# EAGLE design PCB (EAGLE 9.2.0)
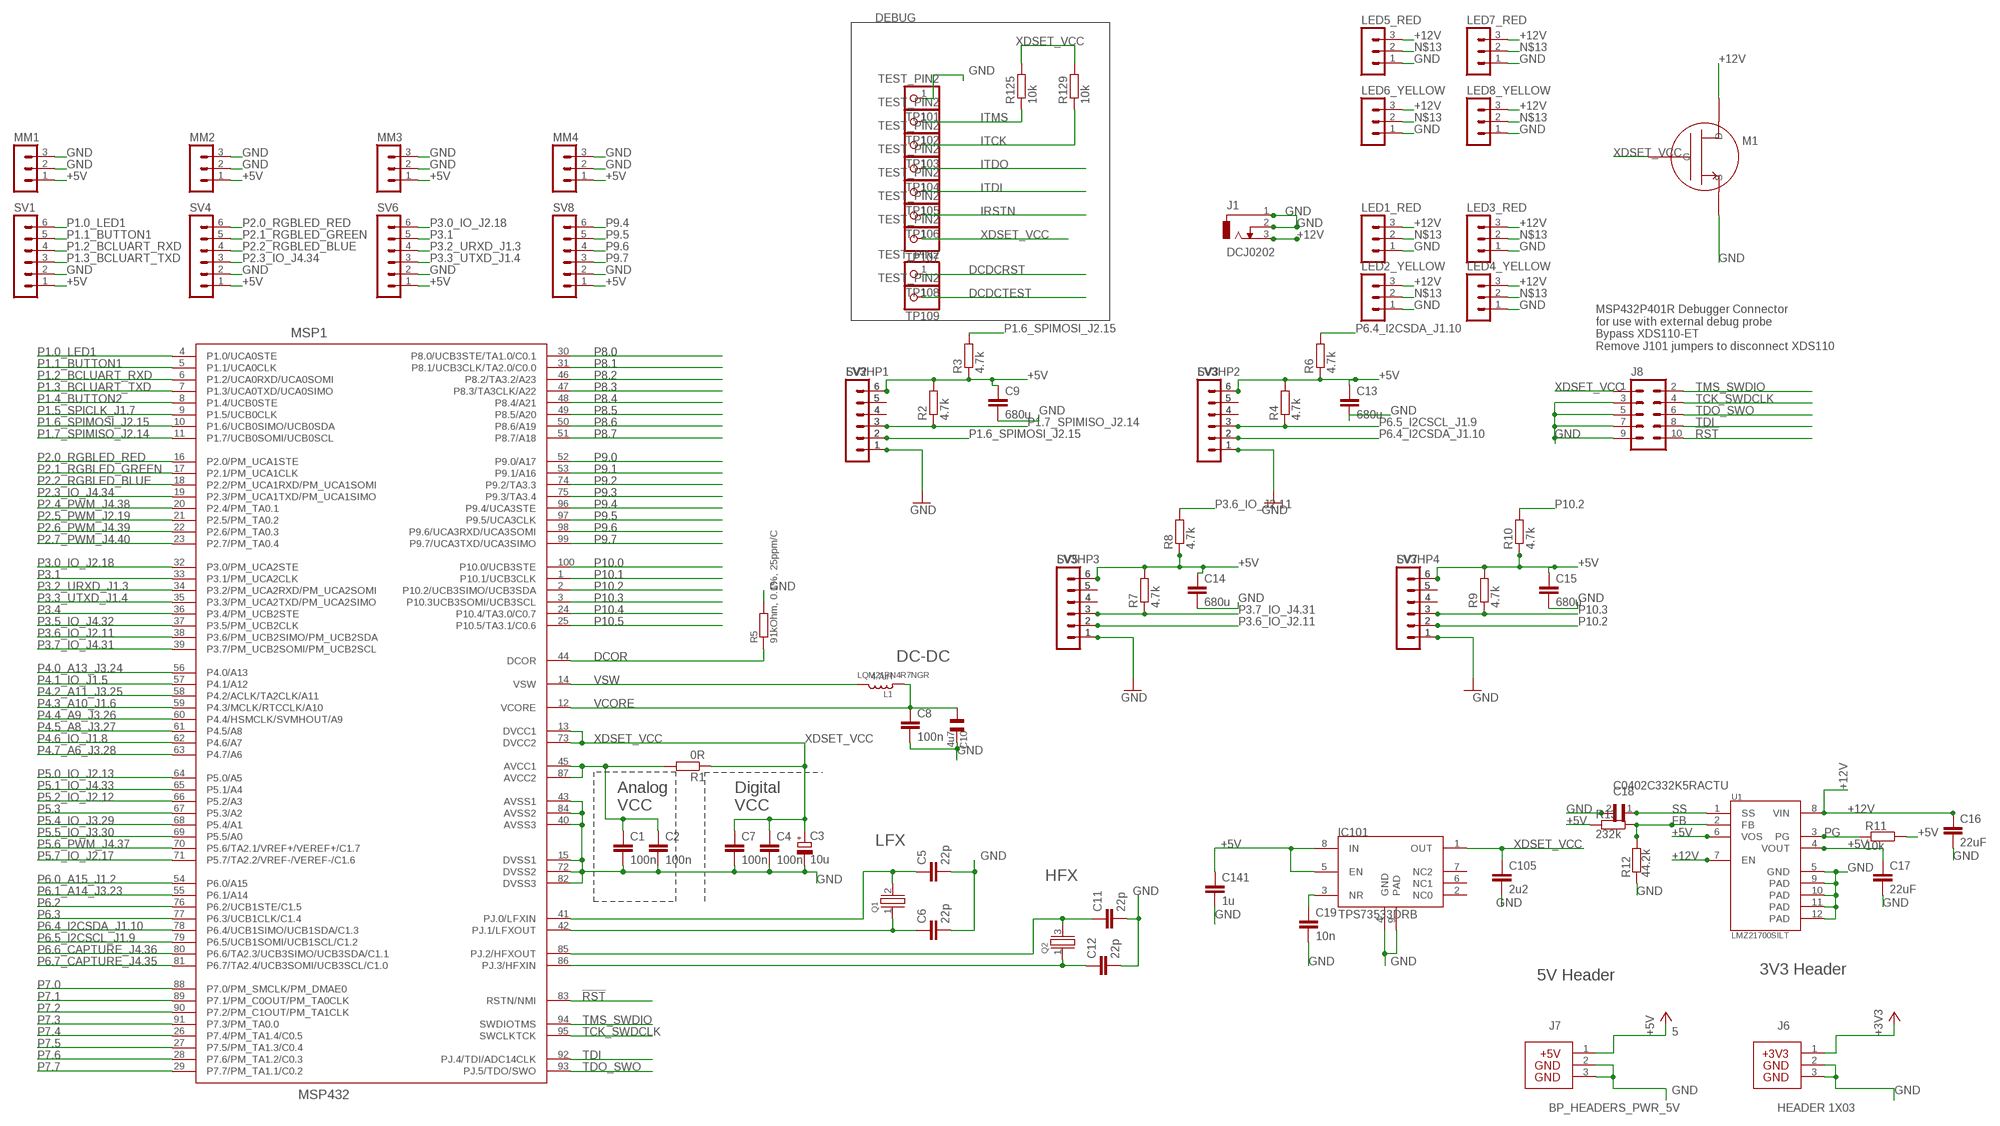
[diagram p0: schematic, sheet 1]

## Parts
C1  100n  C-EUCM0402  [0402]
C2  100n  C-EUCM0402  [0402]
C3  10u  CPOL-EUA/3216-18R  [A/3216-18R]
C4  100n  C-EUCM0402  [0402]
C5  22p  C-EUCM0402  [0402]
C6  22p  C-EUCM0402  [0402]
C7  100n  C-EUCM0402  [0402]
C8  100n  C-EUCM0402  [0402]
C9  680u  C-EUCM0402  [0402]
C10  4u7  CSMD0805  [CSMD0805]
C11  22p  C-EUCM0402  [0402]
C12  22p  C-EUCM0402  [0402]
C13  680u  C-EUCM0402  [0402]
C14  680u  C-EUCM0402  [0402]
C15  680u  C-EUCM0402  [0402]
C16  22uF  22UF-0805-6.3V-20%  [0805]
C17  22uF  22UF-0805-6.3V-20%  [0805]
C18  C0402C332K5RACTU  [CAPC1005X55N]
C19  10n  C-EUC0603  [C0603]
C105  2u2  C-EUC0603  [C0603]
C141  1u  C-EUC0603  [C0603]
IC101  TPS73533DRB  TPS73633DRB  [SON8]
J1  DCJ0202  [DCJ0202]
J6  HEADER 1X03  BP_HEADERS_PWR_3V3100-TH  [3PIN_PWR_3V3]
J7  BP_HEADERS_PWR_5V  [3PIN_PWR_5V]
J8  DEBUG_ARM-10  [ARM-10]
L1  4.7uH  LQM2MP_G0  [0806]
LED1_RED  MA03-1  [MA03-1]
LED2_YELLOW  MA03-1  [MA03-1]
LED3_RED  MA03-1  [MA03-1]
LED4_YELLOW  MA03-1  [MA03-1]
LED5_RED  MA03-1  [MA03-1]
LED6_YELLOW  MA03-1  [MA03-1]
LED7_RED  MA03-1  [MA03-1]
LED8_YELLOW  MA03-1  [MA03-1]
LV3HP1  MA06-1  [MA06-1]
LV3HP2  MA06-1  [MA06-1]
LV3HP3  MA06-1  [MA06-1]
LV3HP4  MA06-1  [MA06-1]
M1  FET_N  (no package)
MM1  MA03-1  [MA03-1]
MM2  MA03-1  [MA03-1]
MM3  MA03-1  [MA03-1]
MM4  MA03-1  [MA03-1]
MSP1  MSP432  [PZ100]
Q1  CRYSTALLF_GENERAL  [LF_XTAL]
Q2  CRYSTALEPSON_FA-238  [FA-238]
R1  0R  R-EU_RM0402  [0402]
R2  4.7k  R-EU_RM0402  [0402]
R3  4.7k  R-EU_RM0402  [0402]
R4  4.7k  R-EU_RM0402  [0402]
R5  91kOhm, 0.1%, 25ppm/C  R_0805  [0805]
R6  4.7k  R-EU_RM0402  [0402]
R7  4.7k  R-EU_RM0402  [0402]
R8  4.7k  R-EU_RM0402  [0402]
R9  4.7k  R-EU_RM0402  [0402]
R10  4.7k  R-EU_RM0402  [0402]
R11  10k  SMK  [SMK]
R12  44.2k  SMK  [SMK]
R13  232k  SMK  [SMK]
R125  10k  R-EU_RM0402  [0402]
R129  10k  R-EU_RM0402  [0402]
SV1  MA06-1  [MA06-1]
SV2  MA06-1  [MA06-1]
SV3  MA06-1  [MA06-1]
SV4  MA06-1  [MA06-1]
SV5  MA06-1  [MA06-1]
SV6  MA06-1  [MA06-1]
SV7  MA06-1  [MA06-1]
SV8  MA06-1  [MA06-1]
TP101  TEST_PIN2  PINHD-1X1  [1X01]
TP102  TEST_PIN2  PINHD-1X1  [1X01]
TP103  TEST_PIN2  PINHD-1X1  [1X01]
TP104  TEST_PIN2  PINHD-1X1  [1X01]
TP105  TEST_PIN2  PINHD-1X1  [1X01]
TP106  TEST_PIN2  PINHD-1X1  [1X01]
TP107  TEST_PIN2  PINHD-1X1  [1X01]
TP108  TEST_PIN2  PINHD-1X1  [1X01]
TP109  TEST_PIN2  PINHD-1X1  [1X01]
U1  LMZ21700SILT  [DFN350X350X175-10RN]

## Nets
5: J7.1 ; supply symbol labelled +5V
!RST: J8.10 MSP1.83(RSTN/NMI)
+3V3: J6.1
+5V: C9.1 C13.1 C14.1 C15.1 C17.1 C141.1 IC101.5(EN) IC101.8(IN) LV3HP1.6 LV3HP2.6 LV3HP3.6 LV3HP4.6 MM1.1 MM2.1 MM3.1 MM4.1 R2.2 R3.1 R4.2 R6.1 R7.2 R8.1 R9.2 R10.1 R11.1 R13.2 SV1.1 SV2.6 SV3.6 SV4.1 SV5.6 SV6.1 SV7.6 SV8.1 U1.4(VOUT) U1.6(VOS)
+12V: C16.1 J1.3 LED1_RED.3 LED2_YELLOW.3 LED3_RED.3 LED4_YELLOW.3 LED5_RED.3 LED6_YELLOW.3 LED7_RED.3 LED8_YELLOW.3 M1.D U1.7(EN) U1.8(VIN)
DCDCRST: TP108.1
DCDCTEST: TP109.1
DCOR: MSP1.44(DCOR) R5.1
FB: R12.1 R13.1 U1.2(FB)
GND: C1.2 C2.2 C3.- C4.2 C5.2 C6.2 C7.2 C8.2 C9.2 C10.2 C11.2 C12.2 C13.2 C14.2 C15.2 C16.2 C17.2 C18.2 C19.2 C105.2 C141.2 IC101.4(GND) IC101.9(PAD) J1.1 J1.2 J6.2 J6.3 J7.2 J7.3 J8.3 J8.5 J8.7 J8.9 LED1_RED.1 LED2_YELLOW.1 LED3_RED.1 LED4_YELLOW.1 LED5_RED.1 LED6_YELLOW.1 LED7_RED.1 LED8_YELLOW.1 LV3HP1.1 LV3HP2.1 LV3HP3.1 LV3HP4.1 M1.S MM1.2 MM1.3 MM2.2 MM2.3 MM3.2 MM3.3 MM4.2 MM4.3 MSP1.15(DVSS1) MSP1.40(AVSS3) MSP1.43(AVSS1) MSP1.72(DVSS2) MSP1.82(DVSS3) MSP1.84(AVSS2) R5.2 R12.2 SV1.2 SV2.1 SV3.1 SV4.2 SV5.1 SV6.2 SV7.1 SV8.2 TP101.1
IRSTN: TP106.1
ITCK: R129.1 TP103.1
ITDI: TP105.1
ITDO: TP104.1
ITMS: R125.1 TP102.1
N$1: LV3HP2.4 SV3.4
N$2: LV3HP2.5 SV3.5
N$3: LV3HP3.4 SV5.4
N$4: LV3HP1.4 SV2.4
N$5: LV3HP1.5 SV2.5
N$6: C1.1 C2.1 MSP1.45(AVCC1) MSP1.87(AVCC2) R1.2
N$7: LV3HP3.5 SV5.5
N$8: LV3HP4.4 SV7.4
N$9: LV3HP4.5 SV7.5
N$10: U1.5(GND) U1.9(PAD) U1.10(PAD) U1.11(PAD) U1.12(PAD)
N$11: C19.1 IC101.3(NR)
N$13: LED1_RED.2 LED2_YELLOW.2 LED3_RED.2 LED4_YELLOW.2 LED5_RED.2 LED6_YELLOW.2 LED7_RED.2 LED8_YELLOW.2
N$34: C6.1 MSP1.42(PJ.1/LFXOUT) Q1.1
N$38: C5.1 MSP1.41(PJ.0/LFXIN) Q1.2
P1.0_LED1: MSP1.4(P1.0/UCA0STE) SV1.6
P1.1_BUTTON1: MSP1.5(P1.1/UCA0CLK) SV1.5
P1.2_BCLUART_RXD: MSP1.6(P1.2/UCA0RXD/UCA0SOMI) SV1.4
P1.3_BCLUART_TXD: MSP1.7(P1.3/UCA0TXD/UCA0SIMO) SV1.3
P1.4_BUTTON2: MSP1.8(P1.4/UCB0STE)
P1.5_SPICLK_J1.7: MSP1.9(P1.5/UCB0CLK)
P1.6_SPIMOSI_J2.15: LV3HP1.2 MSP1.10(P1.6/UCB0SIMO/UCB0SDA) R3.2 SV2.2
P1.7_SPIMISO_J2.14: LV3HP1.3 MSP1.11(P1.7/UCB0SOMI/UCB0SCL) R2.1 SV2.3
P2.0_RGBLED_RED: MSP1.16(P2.0/PM_UCA1STE) SV4.6
P2.1_RGBLED_GREEN: MSP1.17(P2.1/PM_UCA1CLK) SV4.5
P2.2_RGBLED_BLUE: MSP1.18(P2.2/PM_UCA1RXD/PM_UCA1SOMI) SV4.4
P2.3_IO_J4.34: MSP1.19(P2.3/PM_UCA1TXD/PM_UCA1SIMO) SV4.3
P2.4_PWM_J4.38: MSP1.20(P2.4/PM_TA0.1)
P2.5_PWM_J2.19: MSP1.21(P2.5/PM_TA0.2)
P2.6_PWM_J4.39: MSP1.22(P2.6/PM_TA0.3)
P2.7_PWM_J4.40: MSP1.23(P2.7/PM_TA0.4)
P3.0_IO_J2.18: MSP1.32(P3.0/PM_UCA2STE) SV6.6
P3.1: MSP1.33(P3.1/PM_UCA2CLK) SV6.5
P3.2_URXD_J1.3: MSP1.34(P3.2/PM_UCA2RXD/PM_UCA2SOMI) SV6.4
P3.3_UTXD_J1.4: MSP1.35(P3.3/PM_UCA2TXD/PM_UCA2SIMO) SV6.3
P3.4: MSP1.36(P3.4/PM_UCB2STE)
P3.5_IO_J4.32: MSP1.37(P3.5/PM_UCB2CLK)
P3.6_IO_J2.11: LV3HP3.2 MSP1.38(P3.6/PM_UCB2SIMO/PM_UCB2SDA) R8.2 SV5.2
P3.7_IO_J4.31: LV3HP3.3 MSP1.39(P3.7/PM_UCB2SOMI/PM_UCB2SCL) R7.1 SV5.3
P4.0_A13_J3.24: MSP1.56(P4.0/A13)
P4.1_IO_J1.5: MSP1.57(P4.1/A12)
P4.2_A11_J3.25: MSP1.58(P4.2/ACLK/TA2CLK/A11)
P4.3_A10_J1.6: MSP1.59(P4.3/MCLK/RTCCLK/A10)
P4.4_A9_J3.26: MSP1.60(P4.4/HSMCLK/SVMHOUT/A9)
P4.5_A8_J3.27: MSP1.61(P4.5/A8)
P4.6_IO_J1.8: MSP1.62(P4.6/A7)
P4.7_A6_J3.28: MSP1.63(P4.7/A6)
P5.0_IO_J2.13: MSP1.64(P5.0/A5)
P5.1_IO_J4.33: MSP1.65(P5.1/A4)
P5.2/XT2IN: C12.1 MSP1.86(PJ.3/HFXIN) Q2.1
P5.2_IO_J2.12: MSP1.66(P5.2/A3)
P5.3: MSP1.67(P5.3/A2)
P5.3/XT2OUT: C11.1 MSP1.85(PJ.2/HFXOUT) Q2.3
P5.4_IO_J3.29: MSP1.68(P5.4/A1)
P5.5_IO_J3.30: MSP1.69(P5.5/A0)
P5.6_PWM_J4.37: MSP1.70(P5.6/TA2.1/VREF+/VEREF+/C1.7)
P5.7_IO_J2.17: MSP1.71(P5.7/TA2.2/VREF-/VEREF-/C1.6)
P6.0_A15_J1.2: MSP1.54(P6.0/A15)
P6.1_A14_J3.23: MSP1.55(P6.1/A14)
P6.2: MSP1.76(P6.2/UCB1STE/C1.5)
P6.3: MSP1.77(P6.3/UCB1CLK/C1.4)
P6.4_I2CSDA_J1.10: LV3HP2.2 MSP1.78(P6.4/UCB1SIMO/UCB1SDA/C1.3) R6.2 SV3.2
P6.5_I2CSCL_J1.9: LV3HP2.3 MSP1.79(P6.5/UCB1SOMI/UCB1SCL/C1.2) R4.1 SV3.3
P6.6_CAPTURE_J4.36: MSP1.80(P6.6/TA2.3/UCB3SIMO/UCB3SDA/C1.1)
P6.7_CAPTURE_J4.35: MSP1.81(P6.7/TA2.4/UCB3SOMI/UCB3SCL/C1.0)
P7.0: MSP1.88(P7.0/PM_SMCLK/PM_DMAE0)
P7.1: MSP1.89(P7.1/PM_C0OUT/PM_TA0CLK)
P7.2: MSP1.90(P7.2/PM_C1OUT/PM_TA1CLK)
P7.3: MSP1.91(P7.3/PM_TA0.0)
P7.4: MSP1.26(P7.4/PM_TA1.4/C0.5)
P7.5: MSP1.27(P7.5/PM_TA1.3/C0.4)
P7.6: MSP1.28(P7.6/PM_TA1.2/C0.3)
P7.7: MSP1.29(P7.7/PM_TA1.1/C0.2)
P8.0: MSP1.30(P8.0/UCB3STE/TA1.0/C0.1)
P8.1: MSP1.31(P8.1/UCB3CLK/TA2.0/C0.0)
P8.2: MSP1.46(P8.2/TA3.2/A23)
P8.3: MSP1.47(P8.3/TA3CLK/A22)
P8.4: MSP1.48(P8.4/A21)
P8.5: MSP1.49(P8.5/A20)
P8.6: MSP1.50(P8.6/A19)
P8.7: MSP1.51(P8.7/A18)
P9.0: MSP1.52(P9.0/A17)
P9.1: MSP1.53(P9.1/A16)
P9.2: MSP1.74(P9.2/TA3.3)
P9.3: MSP1.75(P9.3/TA3.4)
P9.4: MSP1.96(P9.4/UCA3STE) SV8.6
P9.5: MSP1.97(P9.5/UCA3CLK) SV8.5
P9.6: MSP1.98(P9.6/UCA3RXD/UCA3SOMI) SV8.4
P9.7: MSP1.99(P9.7/UCA3TXD/UCA3SIMO) SV8.3
P10.0: MSP1.100(P10.0/UCB3STE)
P10.1: MSP1.1(P10.1/UCB3CLK)
P10.2: LV3HP4.2 MSP1.2(P10.2/UCB3SIMO/UCB3SDA) R10.2 SV7.2
P10.3: LV3HP4.3 MSP1.3(P10.3UCB3SOMI/UCB3SCL) R9.1 SV7.3
P10.4: MSP1.24(P10.4/TA3.0/C0.7)
P10.5: MSP1.25(P10.5/TA3.1/C0.6)
PG: R11.2 U1.3(PG)
SS: C18.1 U1.1(SS)
TCK_SWDCLK: J8.4 MSP1.95(SWCLKTCK)
TDI: J8.8 MSP1.92(PJ.4/TDI/ADC14CLK)
TDO_SWO: J8.6 MSP1.93(PJ.5/TDO/SWO)
TMS_SWDIO: J8.2 MSP1.94(SWDIOTMS)
VCORE: C8.1 C10.1 L1.1 MSP1.12(VCORE)
VSW: L1.2 MSP1.14(VSW)
XDSET_VCC: C3.+ C4.1 C7.1 C105.1 IC101.1(OUT) J8.1 M1.G MSP1.13(DVCC1) MSP1.73(DVCC2) R1.1 R125.2 R129.2 TP107.1
Unconnected: IC101.2(NC0) IC101.6(NC1) IC101.7(NC2)

## Notes on the sheet
- DEBUG
- MSP432P401R Debugger Connector
  for use with external debug probe
  Bypass XDS110-ET
  Remove J101 jumpers to disconnect XDS110
- DC-DC
- LQM21PN4R7NGR
- Analog | Digital
- VCC | VCC
- LFX
- HFX
- 3V3 Header
- 5V Header

## Library data of the parts
C1 C2 C4-C9 C11-C15 C19 C105 C141 = rcl:C-EU: CAPACITOR, European symbol
C3 = rcl:CPOL-EU: POLARIZED CAPACITOR, European symbol
C10 = cap:CSMD0805
C16 C17 = SparkFun-Capacitors:22UF: 22µF ceramic capacitors A capacitor is a passive two-terminal electrical component used to store electrical energy temporarily in an electric field.; PROD_ID: CAP-08402
C18 = C0402C332K5RACTU:C0402C332K5RACTU: CAPACITOR MLCC, 3300PF, 50V, 10%, 0402; Product Range:KEMET - C Series; Capacitance:3300pF; Capacitance Tolerance:± 10%; Dielectric Characteristic:X7R; Voltage Rating:50V; Capacitor Case Style:0402 [1005 Metric]; Operating ;RoHS Compliant: Yes; AVAILABILITY: Unavailable; DESCRIPTION: Capacitor; Ceramic; Cap; 3300pf ; Tol+10%; Smd; Vol-Rtg 50v; X7r; MF: KEMET; MP: C0402C332K5RACTU; PACKAGE: 0402 KEMET; PRICE: None
IC101 = MSP430G6_LP:TPS73633DRB
J1 = con-jack:DCJ0202: DC POWER JACK Source: DCJ0202.pdf; OC_FARNELL: unknown; OC_NEWARK: unknown
J6 = LaunchPad_Template_Library:BP_HEADERS_PWR_3V3; CCO: 258-0001299; DESCRIPTION: CONN HEADER .100 SINGL STR 3POS; MAN: SULLINS
J7 = LaunchPad_Template_Library:BP_HEADERS_PWR_5V
J8 = MSP430_Headers:DEBUG_ARM-10; SAMTEC: FTSH-105-01-F-D-K
L1 = Murata:LQM2MP_G0
LED1_RED LED2_YELLOW LED3_RED LED4_YELLOW LED5_RED LED6_YELLOW LED7_RED LED8_YELLOW MM1-MM4 = con-lstb:MA03-1: PIN HEADER; OC_FARNELL: unknown; OC_NEWARK: unknown
LV3HP1-LV3HP4 SV1-SV8 = con-lstb:MA06-1: PIN HEADER; OC_FARNELL: unknown; OC_NEWARK: unknown
M1 = ngspice-simulation:FET_N: N-Type MOS Field Effect Transistor (MOSFET)
MSP1 = MSP-EXP432:MSP432
Q1 Q2 = MSP_Crystals:CRYSTAL
R1-R4 R6-R10 R125 R129 = rcl:R-EU_: RESISTOR, European symbol
R5 = smd:R_0805
R11-R13 = resistor-shunt:SMK: SMD SHUNT RESISTOR; OC_FARNELL: unknown; OC_NEWARK: unknown
TP101-TP109 = pinhead:PINHD-1X1: PIN HEADER
U1 = LMZ21700SILT:LMZ21700SILT: 650mA SIMPLE SWITCHER? Nano Module with 17V Maximum Input Voltage 8-uSiP -40 to 125; AVAILABILITY: Unavailable; DESCRIPTION: 650mA SIMPLE SWITCHER? Nano Module with 17V Maximum Input Voltage 8-uSiP -40 to 125; MF: Texas Instruments; MP: LMZ21700SILT; PACKAGE: SMD-8 Texas Instruments; PRICE: None

## Net classes
0 default: width 0.254 mm
2 Power: width 0.203 mm, drill 0.305 mm, clearance 0.152 mm to class 0, clearance 0.152 mm to class 1, clearance 0.152 mm

## Board
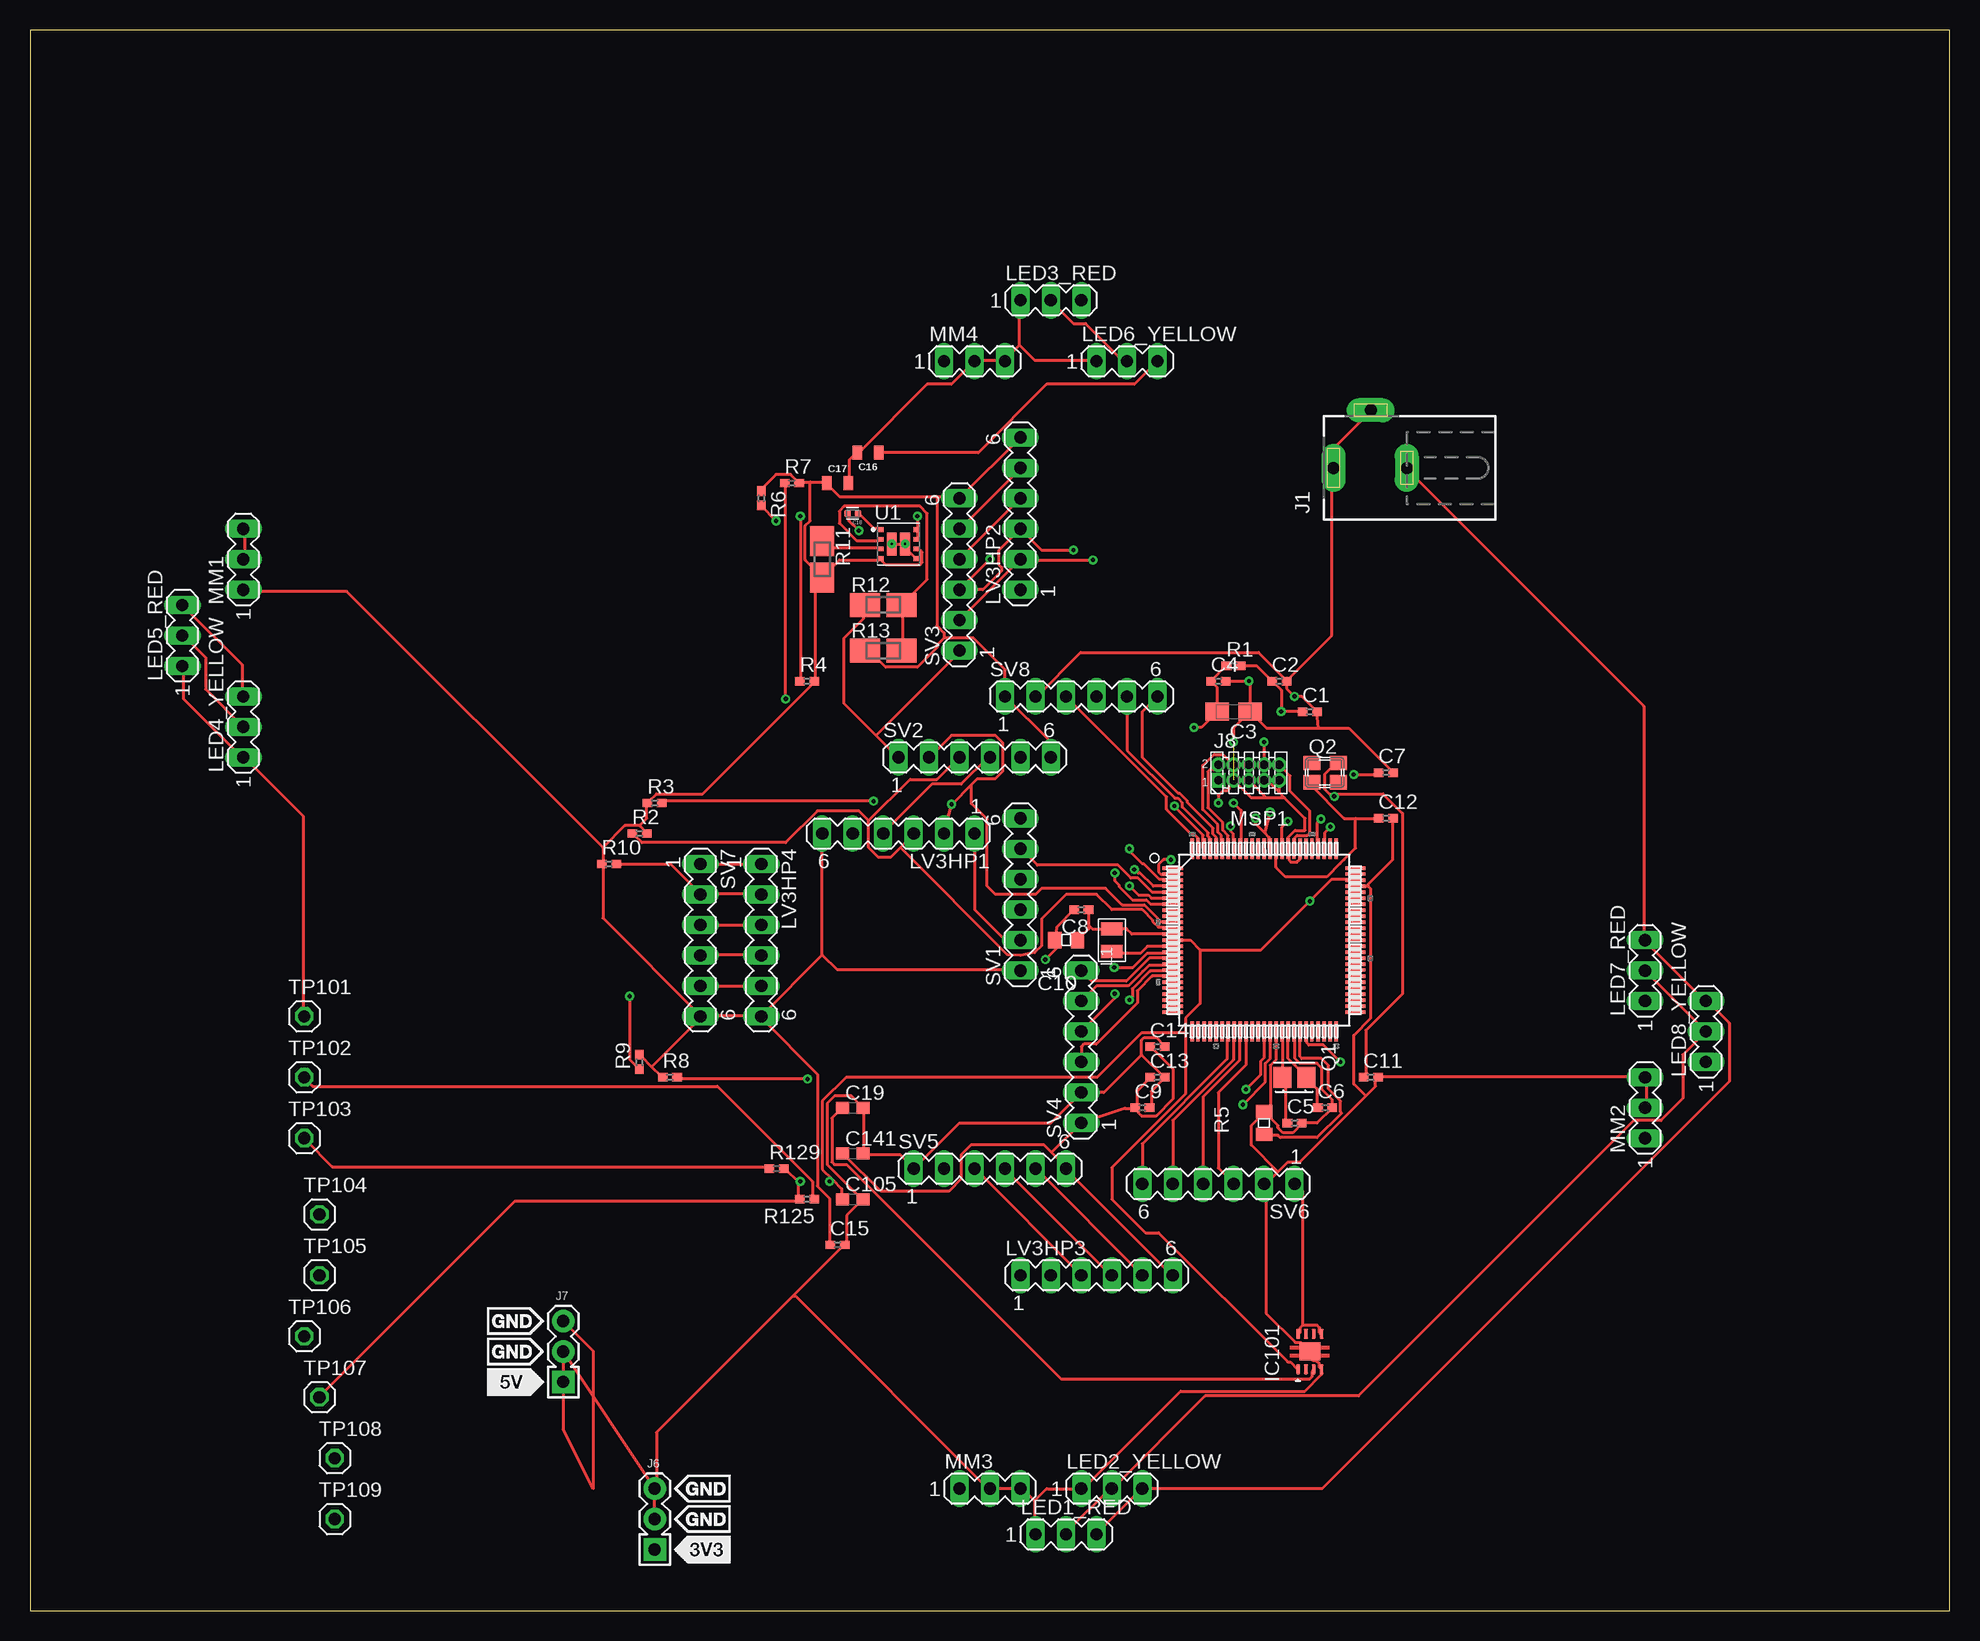
[diagram p1: board, top side]
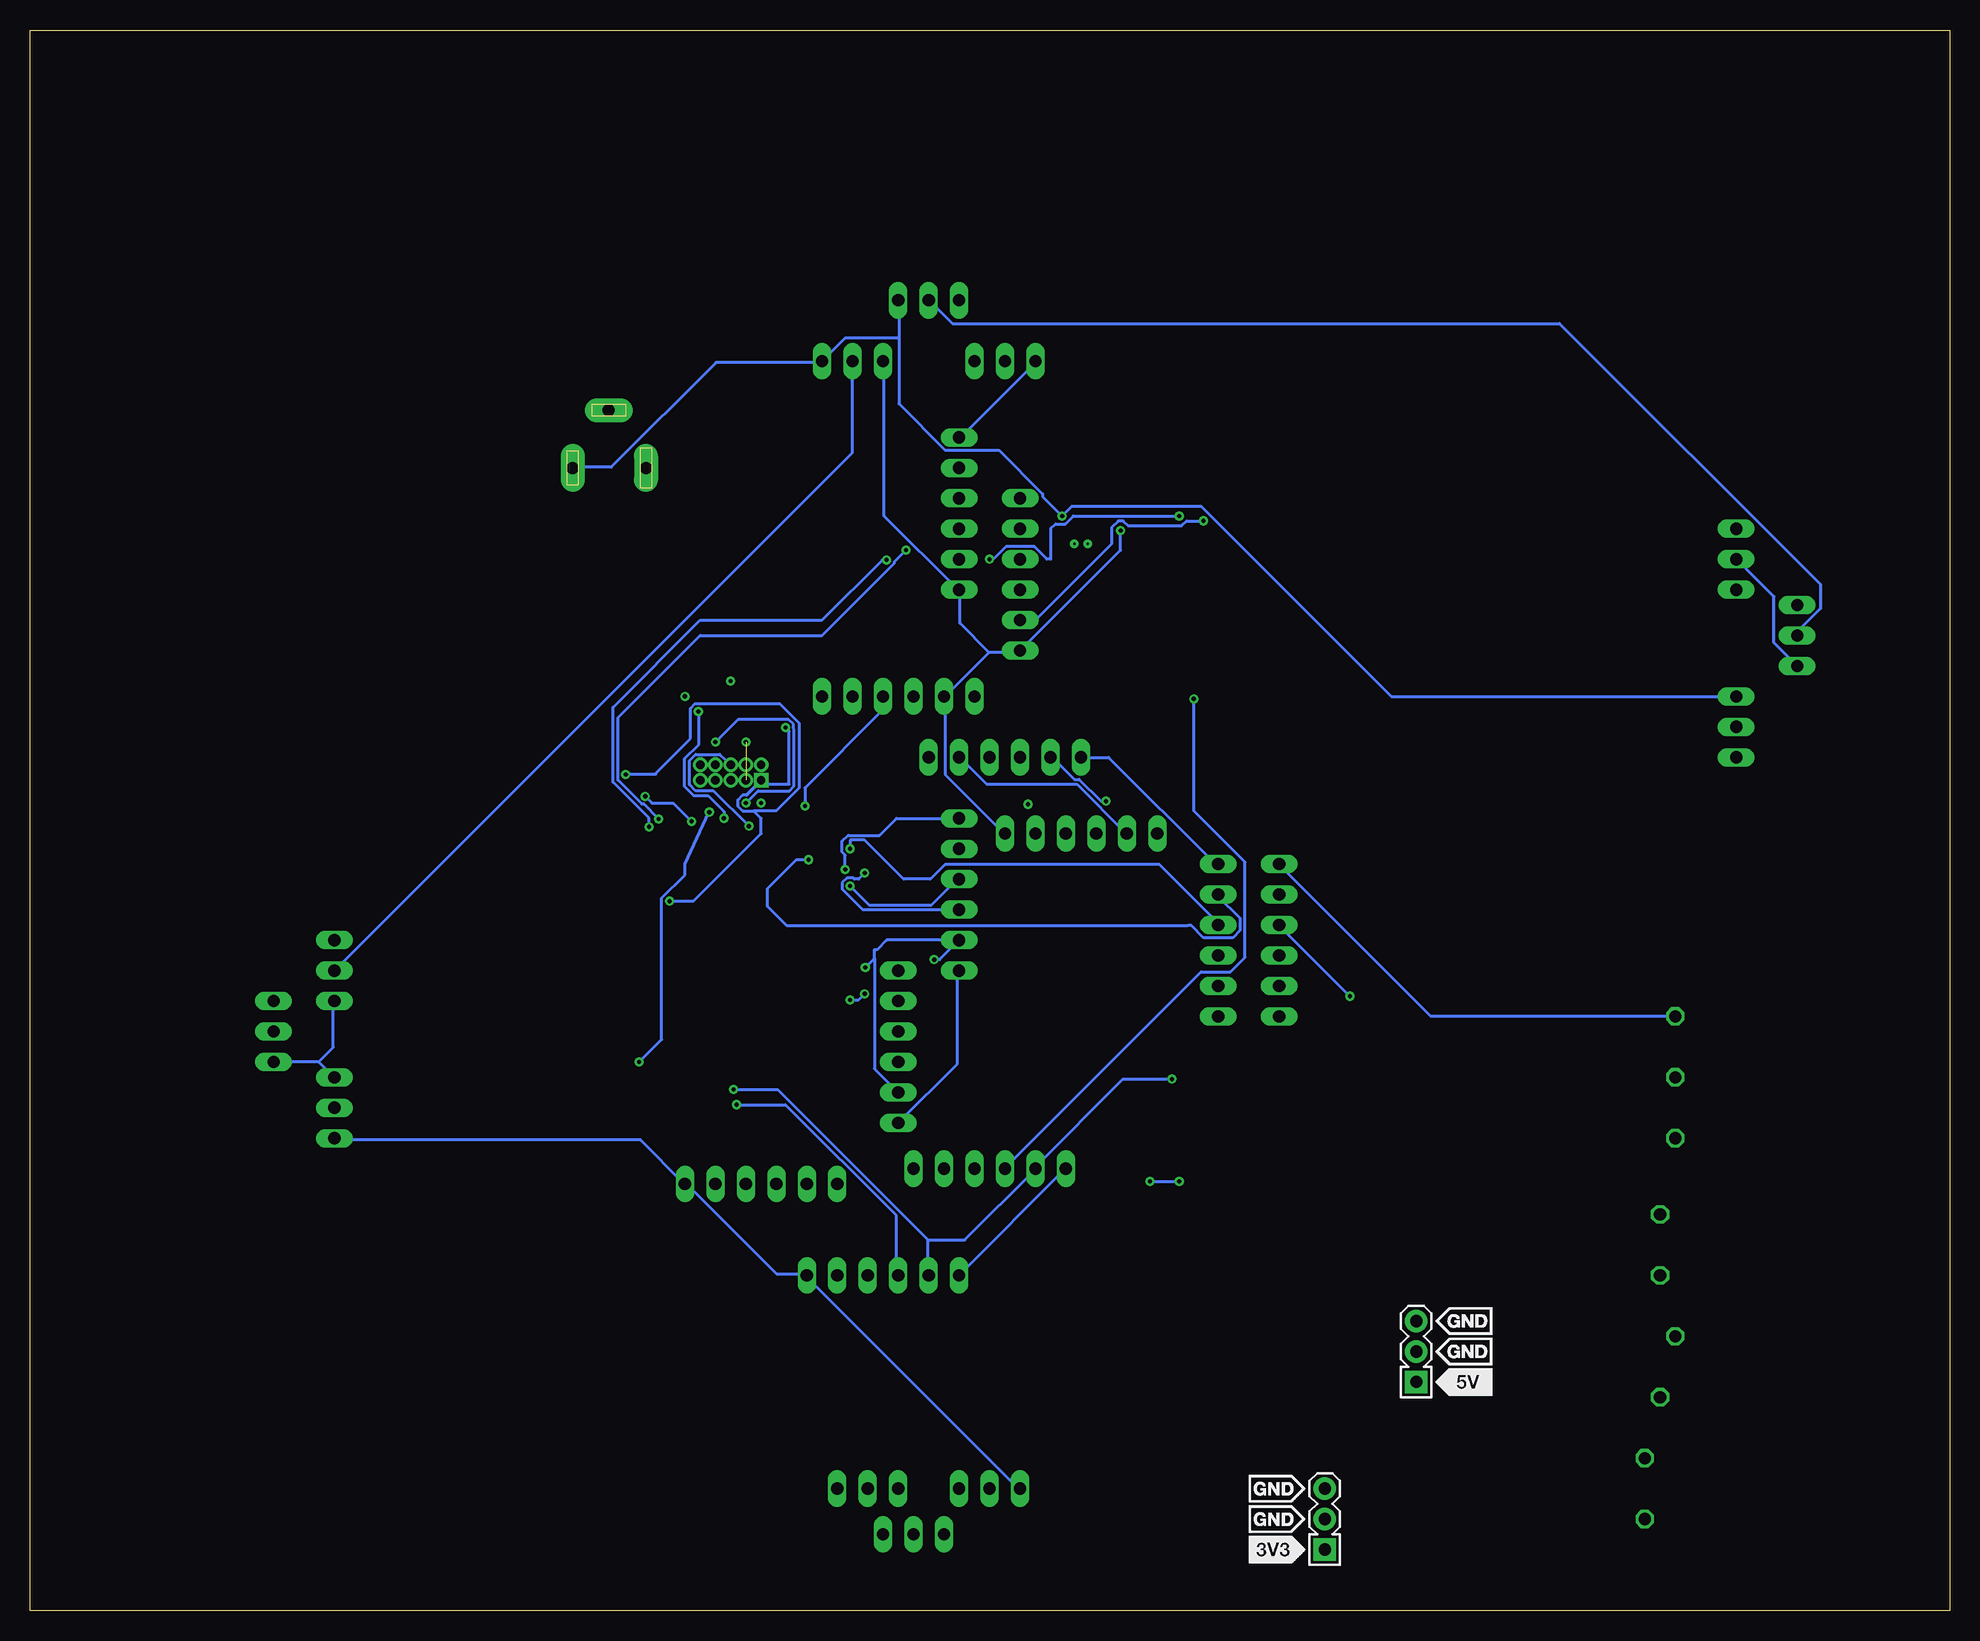
[diagram p2: board, bottom side, seen from below]

Size 160 x 131.75 mm. Coordinates in mm from the lower left corner, seen from the top.
Outline: 0,0 160,0 160,131.75 0,131.75 0,0
Copper layers (1*16): Top 0.035mm / dielectric 1.5mm / Bottom 0.035mm
Design rules "default": minimum track width 6mil, minimum drill 0.35mm, track to track 6mil, track to pad 6mil, pad to pad 6mil, via to via 6mil, smd to smd 6mil, copper to edge 40mil, drill to drill 6mil, minimum pad ring 10mil, minimum via ring 8mil, stop-mask expansion 4mil, vias tented up to drill 0mil, thermal gap 10mil

### Footprints (pad centres in the part's own frame; a part is rotated, then mirrored left to right if it is on the bottom)
0402 = smd 0.8 x 0.7: 1 -0.6,0; 2 0.6,0
A/3216-18R = smd 1.95 x 1.5: + 1.375,0; - -1.375,0
CSMD0805 = smd 1.092 x 1.397: 1 -0.94,0; 2 0.94,0
0805 = smd 0.8 x 1.2: 1 -0.9,0; 2 0.9,0
CAPC1005X55N = smd 0.54 x 0.6: 1 -0.43,0; 2 0.43,0
C0603 = smd 1.1 x 1: 1 -0.85,0; 2 0.85,0
SON8 = smd 0.85 x 0.35: 1 -1.475,0.975; 2 -1.475,0.325; 3 -1.475,-0.325; 4 -1.475,-0.975; 5 1.475,-0.975; 6 1.475,-0.325; 7 1.475,0.325; 8 1.475,0.975 | smd 1.5 x 1.75: 9 0,0
DCJ0202 = drill 1 pad 2 long: 1 0,3.1; 2 4.8,0; 3 0,-3
3PIN_PWR_3V3 = drill 1.016 pad 1.88 square: 1 0,0 | drill 1.016 pad 1.88: 2 0,2.54; 3 0,5.08
3PIN_PWR_5V = drill 1.016 pad 1.88 square: 1 0,0 | drill 1.016 pad 1.88: 2 0,2.54; 3 0,5.08
ARM-10 = drill 0.7 pad 0.95 square: 1 -2.54,-0.635 | drill 0.7 pad 0.95: 2 -2.54,0.635; 3 -1.27,-0.635; 4 -1.27,0.635; 5 0,-0.635; 6 0,0.635; 7 1.27,-0.635; 8 1.27,0.635; 9 2.54,-0.635; 10 2.54,0.635
0806 = smd 1.1 x 1.8: 1 -0.94,0; 2 0.94,0
MA03-1 = drill 1.016 long: 1 -2.54,0; 2 0,0; 3 2.54,0
MA06-1 = drill 1.016 long: 1 -6.35,0; 2 -3.81,0; 3 -1.27,0; 4 1.27,0; 5 3.81,0; 6 6.35,0
PZ100 = smd 1.676 x 0.279: 1 -7.62,5.994; 2 -7.62,5.512; 3 -7.62,5.004; 4 -7.62,4.496; 5 -7.62,3.988; 6 -7.62,3.505; 7 -7.62,2.997; 8 -7.62,2.489; 9 -7.62,2.007; 10 -7.62,1.499; 11 -7.62,0.991; 12 -7.62,0.508; 13 -7.62,0; 14 -7.62,-0.508; 15 -7.62,-0.991; 16 -7.62,-1.499; 17 -7.62,-2.007; 18 -7.62,-2.489; 19 -7.62,-2.997; 20 -7.62,-3.505; 21 -7.62,-3.988; 22 -7.62,-4.496; 23 -7.62,-5.004; 24 -7.62,-5.512; 25 -7.62,-5.994; 51 7.62,-5.994; 52 7.62,-5.512; 53 7.62,-5.004; 54 7.62,-4.496; 55 7.62,-3.988; 56 7.62,-3.505; 57 7.62,-2.997; 58 7.62,-2.489; 59 7.62,-2.007; 60 7.62,-1.499; 61 7.62,-0.991; 62 7.62,-0.508; 63 7.62,0; 64 7.62,0.508; 65 7.62,0.991; 66 7.62,1.499; 67 7.62,2.007; 68 7.62,2.489; 69 7.62,2.997; 70 7.62,3.505; 71 7.62,3.988; 72 7.62,4.496; 73 7.62,5.004; 74 7.62,5.512; 75 7.62,5.994 | smd 0.279 x 1.676: 26 -5.994,-7.62; 27 -5.512,-7.62; 28 -5.004,-7.62; 29 -4.496,-7.62; 30 -3.988,-7.62; 31 -3.505,-7.62; 32 -2.997,-7.62; 33 -2.489,-7.62; 34 -2.007,-7.62; 35 -1.499,-7.62; 36 -0.991,-7.62; 37 -0.508,-7.62; 38 0,-7.62; 39 0.508,-7.62; 40 0.991,-7.62; 41 1.499,-7.62; 42 2.007,-7.62; 43 2.489,-7.62; 44 2.997,-7.62; 45 3.505,-7.62; 46 3.988,-7.62; 47 4.496,-7.62; 48 5.004,-7.62; 49 5.512,-7.62; 50 5.994,-7.62; 76 5.994,7.62; 77 5.512,7.62; 78 5.004,7.62; 79 4.496,7.62; 80 3.988,7.62; 81 3.505,7.62; 82 2.997,7.62; 83 2.489,7.62; 84 2.007,7.62; 85 1.499,7.62; 86 0.991,7.62; 87 0.508,7.62; 88 0,7.62; 89 -0.508,7.62; 90 -0.991,7.62; 91 -1.499,7.62; 92 -2.007,7.62; 93 -2.489,7.62; 94 -2.997,7.62; 95 -3.505,7.62; 96 -3.988,7.62; 97 -4.496,7.62; 98 -5.004,7.62; 99 -5.512,7.62; 100 -5.994,7.62
LF_XTAL = smd 1.75 x 1.5: 1 0,1; 2 0,-1
FA-238 = smd 1.4 x 1.2: 1 -1.1,-0.8; 2 1.1,-0.8; 3 1.1,0.8; 4 -1.1,0.8
0805' = smd 1.092 x 1.397: 1 -0.94,0; 2 0.94,0
SMK = smd 2.5 x 2: 1 1.524,0; 2 -1.524,0
1X01 = drill 1.016 octagon: 1 0,0
DFN350X350X175-10RN = smd 0.45 x 0.4: 1 -1.475,1.2; 2 -1.475,0.4; 3 -1.475,-0.4; 4 -1.475,-1.2; 5 1.475,-1.2; 6 1.475,-0.4; 7 1.475,0.4; 8 1.475,1.2 | smd 0.8 x 1.9: 9 -0.55,0; 10 0.55,0 | drill 0.2 pad 0.4: 11 -0.55,0; 12 0.55,0

### Placement (x,y rotation side)
C1  106.68,74.93 0 top
C2  104.14,77.47 0 top
C3  100.33,74.93 180 top
C4  99.06,77.47 0 top
C5  105.41,40.64 0 top
C6  107.95,41.91 0 top
C7  113.03,69.85 0 top
C8  87.63,58.42 180 top
C9  92.71,41.91 0 top
C10  86.36,55.88 180 top
C11  111.76,44.45 0 top
C12  113.03,66.04 0 top
C13  93.98,44.45 0 top
C14  93.98,46.99 0 top
C15  67.31,30.48 0 top
C16  69.85,96.52 180 top
C17  67.31,93.98 0 top
C18  68.58,91.44 180 top
C19  68.58,41.91 0 top
C105  68.58,34.29 0 top
C141  68.58,38.1 0 top
IC101  106.68,21.59 90 top
J1  111.76,95.25 90 top
J6  52.07,5.08 0 top
J7  44.45,19.05 0 top
J8  101.6,69.85 0 top
L1  90.17,55.88 270 top
LED1_RED  86.36,6.35 0 top
LED2_YELLOW  90.17,10.16 0 top
LED3_RED  85.09,109.22 0 top
LED4_YELLOW  17.78,73.66 90 top
LED5_RED  12.7,81.28 90 top
LED6_YELLOW  91.44,104.14 0 top
LED7_RED  134.62,53.34 90 top
LED8_YELLOW  139.7,48.26 90 top
LV3HP1  72.39,64.77 180 top
LV3HP2  82.55,91.44 90 top
LV3HP3  88.9,27.94 0 top
LV3HP4  60.96,55.88 270 top
MM1  17.78,87.63 90 top
MM2  134.62,41.91 90 top
MM3  80.01,10.16 0 top
MM4  78.74,104.14 0 top
MSP1  102.87,55.88 0 top
Q1  105.41,44.45 270 top
Q2  107.95,69.85 0 top
R1  100.33,78.74 0 top
R2  50.8,64.77 0 top
R3  52.07,67.31 0 top
R4  64.77,77.47 0 top
R5  91kOhm, 0.1%, 25ppm/C  [0805']  102.87,40.64 90 top
R6  60.96,92.71 270 top
R7  63.5,93.98 0 top
R8  53.34,44.45 0 top
R9  50.8,45.72 90 top
R10  48.26,62.23 0 top
R11  66.04,87.63 270 top
R12  71.12,83.82 0 top
R13  71.12,80.01 0 top
R125  64.77,34.29 180 top
R129  62.23,36.83 0 top
SV1  82.55,59.69 90 top
SV2  78.74,71.12 0 top
SV3  77.47,86.36 90 top
SV4  87.63,46.99 90 top
SV5  80.01,36.83 0 top
SV6  99.06,35.56 180 top
SV7  55.88,55.88 270 top
SV8  87.63,76.2 0 top
TP101  22.86,49.53 0 top
TP102  22.86,44.45 0 top
TP103  22.86,39.37 0 top
TP104  24.13,33.02 0 top
TP105  24.13,27.94 0 top
TP106  22.86,22.86 0 top
TP107  24.13,17.78 0 top
TP108  25.4,12.7 0 top
TP109  25.4,7.62 0 top
U1  72.39,88.9 0 top

### Tracks (layer width: path | path; a pad name or v marks a point on that pad's centre or on a via)
!RST
  Top 0.254: MSP1.83 105.45,63.59 105.45,64.45 105.61,64.62 106.48,64.62 106.68,64.82 106.68,66.65 105.02,68.31 105.02,69.58 104.51,70.1 104.14,70.1 J8.10
+5V
  Top 0.254: 106.07,23.77 105.87,23.57 105.87,23.16 IC101.8 | 106.07,23.77 107.29,23.77 107.49,23.57 107.49,23.16 IC101.5 | 106.07,23.77 106.07,34.95 105.46,35.56 SV6.1 | 85.17,38.18 86.36,36.98 SV5.6 86.36,36.78 95.1,28.04 LV3HP3.6 | 85.17,38.18 84.53,38.81 78.44,38.81 77.62,38 77.62,35.97 76.61,34.95 70.92,34.95 67.87,38 C141.1 | C13.1 93.27,44.3 92.25,43.28 92.25,42.06 C9.1 92.05,41.86 | 92.05,41.86 92.66,41.25 93.88,41.25 95.3,42.67 95.3,45.11 93.47,46.94 C14.1 | 92.05,41.86 91.29,41.86 SV4.1 85.17,38.18 | 76.2,81.08 75.59,80.47 75.59,80.26 73.97,78.64 71.32,78.64 70.1,79.86 69.7,79.86 R13.2 | 76.2,81.08 78.64,81.08 81.28,78.44 SV8.1 84.94,72.54 84.94,71.12 SV2.6 | LV3HP2.6 SV3.6 77.42,92.86 75.59,92.86 | R6.1 60.96,93.47 62.18,94.69 63.4,94.69 64.01,94.08 R7.2 64.21,94.08 65.02,94.08 | 65.02,94.08 66.24,94.08 C17.1 66.45,93.88 67.46,92.86 75.59,92.86 | 66.04,86.16 67.46,87.58 70.71,87.58 U1.4 70.92,87.58 71.32,87.17 74.17,87.17 74.37,87.38 74.37,88.19 74.17,88.39 73.97,88.39 U1.6 | 65.02,94.08 65.02,90.83 64.62,90.42 64.62,87.58 66.04,86.16 | 66.04,86.16 R11.1 66.04,85.95 65.43,85.34 65.43,77.62 R4.2 65.23,77.42 65.23,77.22 56.08,68.07 52.22,68.07 51.61,67.46 R3.1 51.41,67.26 51.41,66.04 50.8,65.43 | 76.2,81.08 76.2,81.48 75.59,82.09 75.59,92.86 | 51.82,45.31 52.63,44.5 R8.1 | 51.82,45.31 51,46.13 50.8,46.13 R9.2 | 51.82,45.31 55.88,49.38 SV7.6 55.88,49.58 | C15.1 66.65,30.48 66.65,34.34 65.63,35.36 65.63,44.7 60.96,49.38 LV3HP4.6 60.96,49.58 | 66.04,54.66 LV3HP1.6 | 60.96,49.58 66.04,54.66 | 60.96,49.58 55.88,49.58 | 47.75,63.6 47.75,62.38 R10.1 47.75,62.18 47.75,57.71 55.88,49.58
  Top 0.254: 47.75,63.6 49.58,65.43 50.8,65.43 | 50.8,65.43 51.41,64.82 R2.2 | 47.75,63.6 26.42,84.94 17.88,84.94 MM1.1 | 66.04,54.66 67.26,53.44 82.5,53.44 SV1.1
  Bottom 0.254: MM2.1 134.52,39.22 109.12,39.22 105.46,35.56 SV6.1 105.26,35.56 97.74,28.04 95.3,28.04 LV3HP3.6 95.3,27.84 77.62,10.16 MM3.1 | SV1.1 82.7,53.24 82.7,46.99 82.7,46.94 82.7,45.57 SV4.1 | MM4.1 76.2,104.04 82.5,97.74 LV3HP2.6
+12V  (via drill 0.35)
  Top 0.254: LED1_RED.3 89,6.5 92.66,10.16 LED2_YELLOW.3 107.7,10.16 141.63,44.09 141.63,48.97 139.8,50.8 LED8_YELLOW.3 139.6,50.8 134.52,55.88 | C16.1 79.05,96.52 84.73,102.21 92.05,102.21 LED6_YELLOW.3 | LED5_RED.3 17.68,78.84 17.68,76.2 LED4_YELLOW.3 | U1.7 73.97,89.41 73.97,90.02 U1.8 73.97,90.22 v73.97,91.24 | 134.52,55.88 134.52,75.39 114.81,95.1 J1.3 | 134.52,55.88 LED7_RED.3
  Bottom 0.254: J1.3 114.61,95.3 111.56,95.3 102.82,104.04 94.08,104.04 LED6_YELLOW.3 92.05,106.07 87.58,106.07 | 87.58,106.07 87.58,109.12 LED3_RED.3 | 87.58,106.07 87.58,100.58 83.72,96.72 79.25,96.72 75.59,93.07 75.59,92.86 v73.97,91.24 73.15,92.05 62.38,92.05 46.53,76.2 LED4_YELLOW.3
DCOR
  Top 0.254: R5.1 103.02,39.62 104.04,39.62 104.24,39.42 107.29,39.42 109.32,41.45 109.23,41.55 109.23,42.48 108.24,43.47 108.24,45.43 107.66,46.01 106.02,46.01 105.86,46.17 MSP1.44
FB
  Top 0.254: U1.2 70.71,89.2 68.89,89.2 67.46,90.63 67.46,91.64 67.87,92.05 74.17,92.05 74.78,91.44 74.78,85.95 R12.1 72.75,83.72 72.75,80.06 R13.1
GND  (via drill 0.35)  (1 unrouted)
  Top 0.254: MM2.2 134.72,42.06 134.72,44.3 MM2.3 134.52,44.5 112.37,44.5 C11.2 112.17,44.3 112.17,43.69 111.35,42.88 | 106.07,40.64 107.29,40.64 108.51,41.86 C6.2 108.55,42.58 107.7,43.43 107.7,45.18 107.28,45.6 105.85,45.6 105.45,46.01 105.45,48.17 MSP1.43 | 103.35,41.12 104.04,40.44 104.04,40.23 104.44,39.83 105.26,39.83 106.07,40.64 | 103.35,41.12 103.02,41.45 R5.2 | 106.07,40.64 C5.2 | MSP1.40 103.83,48.16 103.83,45.9 103.38,45.44 103.38,41.15 103.35,41.12 | 103.02,41.66 R5.2 | 111.56,60.55 111.35,60.35 110.54,60.35 MSP1.72 | 111.56,60.55 113.59,62.59 113.59,66.04 C12.2 | 106.68,21.54 IC101.9 | 111.35,42.88 105.87,37.39 104.85,37.39 104.04,36.58 | 103.02,35.56 104.04,36.58 | 103.02,35.56 103.02,24.79 105.47,22.34 105.95,22.34 106.11,22.18 106.11,21.7 106.22,21.59 IC101.9 | 106.68,21.74 IC101.9 | 103.02,35.56 SV6.2 | 111.56,60.55 111.56,60.35 111.76,60.15 111.76,49.38 110.34,47.95 110.34,43.89 111.35,42.88 | 104.04,36.58 101.8,38.81 101.8,40.44 102.82,41.45 R5.2 | 83.72,9.14 83.72,6.5 LED1_RED.1 | 83.72,9.14 82.7,10.16 MM3.3 MM3.2 79.86,10.16 63.8,26.21 63.6,26.21 | 83.72,9.14 84.73,10.16 LED2_YELLOW.1 87.78,10.16 95.91,18.29 106.27,18.29 107.66,19.67 IC101.4 107.46,20.31 107.46,20.6 107.24,20.82 106.95,20.82 106.68,21.09 IC101.9 | J7.3 46.94,21.64 46.94,10.16 44.45,15.14 J7.2 J6.3 | J6.3 52.02,10.16 52.02,7.72 J6.2 | SV5.1 73.56,36.98 72.54,38 69.49,38 C141.2 69.49,38.2 69.49,41.86 C19.2 69.29,42.06 68.48,42.88 67.06,42.88 66.45,42.27 66.45,37.19 69.29,34.34 C105.2 69.29,34.14 68.07,32.92 68.07,30.48 C15.2 67.87,30.48 63.6,26.21 | 63.6,26.21 52.22,14.83 52.22,10.16 J6.3
  Top 0.254: MM1.2 17.88,87.78 17.88,90.02 MM1.3 | TP101.1 22.76,49.58 22.76,66.24 17.88,71.12 LED4_YELLOW.1 17.68,71.12 12.8,76 12.8,78.64 LED5_RED.1 | J1.2 111.76,99.97 108.71,96.93 108.71,95.3 J1.1 108.51,95.1 108.51,81.28 104.85,77.62 C2.2 | 101.94,74.78 C3.- | 101.8,74.78 101.94,74.78 | 101.94,74.78 102.01,74.78 | 104.65,77.42 C2.2 | C1.2 107.09,75.03 | 107.41,73.56 109.93,73.56 113.59,69.9 C7.2 | 107.41,73.56 C1.2 | 78.84,64.82 LV3HP1.1 | C9.2 93.47,42.06 93.47,43.28 94.49,44.3 C13.2 94.49,44.5 92.66,46.33 | 92.66,46.33 92.66,47.55 92.86,47.75 93.88,47.75 94.49,47.14 C14.2 | SV4.2 88.01,43.56 | 78.84,64.62 LV3HP1.1 | 82.5,55.88 SV1.2 81.28,55.88 78.74,58.42 LV3HP1.1 | C17.2 68.28,94.08 68.28,95.91 68.89,96.52 C16.2 69.09,96.52 74.78,102.21 76.81,102.21 MM4.2 78.84,104.24 81.28,104.24 | 82.5,105.46 82.5,109.12 LED3_RED.1 | 81.28,104.24 82.5,105.46 | 81.28,104.24 MM4.3 | 82.5,105.46 83.72,104.24 88.8,104.24 LED6_YELLOW.1 | v69.09,90.02 68.28,90.83 68.28,91.44 C18.2 | SV7.1 55.88,62.18 60.96,62.18 LV3HP4.1 | 70.51,72.95 72.34,71.12 SV2.1 | 70.51,72.95 67.87,75.59 67.87,81.08 69.49,82.7 69.49,83.72 R12.2 | 70.51,72.95 77.42,79.86 SV3.1 | C2.2 104.65,77.62 102.41,79.86 87.58,79.86 83.92,76.2 SV8.2 | 73.76,36.98 SV5.1 | 92.66,46.33 89.51,43.18 SV4.2 | SV5.1 77.47,40.64 85.09,40.64 SV4.2 | 79.05,64.77 LV3HP1.1 | C8.2 85.56,56.95 C10.2 85.79,55.41 v84.63,54.25 | v90.37,53.59 91.94,53.59 93.14,54.8 94.99,54.8 95.19,54.87 95.21,54.85 MSP1.15 | C2.2 104.74,76.87 v105.41,76.2 106.01,76.2 C1.2 | C4.2 v101.6,77.47 101.7,77.36 C3.- | C3.- 103.08,73.56 107.41,73.56 | 104.57,67.74 106.27,66.04 106.27,65.02 105.44,65.02 104.85,64.43 104.85,63.6 MSP1.84 104.94,63.44 104.94,62.55 105.1,62.38 105.61,62.38 105.86,62.62 105.86,63.49 MSP1.82
  Top 0.254: 104.57,67.74 104.14,68.17 | 104.14,68.17 J8.9 | 104.14,68.17 103.1,69.22 J8.7 | 104.57,67.74 103.07,67.74 | 103.07,67.74 J8.5 | 103.07,67.74 101.8,67.74 J8.3 99.94,68.83 99.94,68.5 99.78,68.33 99.45,68.33 99.06,67.94 v99.06,67.31 | C3.- 100.33,73.56 v100.33,72.39
  Bottom 0.254: 135.94,45.72 LED8_YELLOW.1 | 135.94,45.72 134.72,44.5 MM2.3 | 135.94,45.72 134.72,46.94 134.72,50.8 LED7_RED.1 | LV3HP3.1 82.5,28.04 73.76,36.78 SV5.1 | LED5_RED.1 14.63,80.67 14.63,84.53 17.68,87.58 MM1.2 | 89.61,54.36 89.61,45.16 SV4.2 | v69.09,90.02 69.09,88.39 SV3.1 77.62,79.86 80.06,79.86 | 80.06,79.86 83.72,76.2 | 80.06,79.86 82.5,82.3 82.5,84.94 LV3HP2.1 82.7,85.14 88.8,91.24 88.8,104.04 LED6_YELLOW.1 | SV2.1 70.1,71.12 61.37,62.38 60.96,62.38 LV3HP4.1 | 83.72,76.2 83.72,69.7 78.84,64.82 LV3HP1.1 | 83.72,76.2 SV8.2 | TP101.1 22.96,49.58 43.28,49.58 55.88,62.18 SV7.1 | v90.37,53.59 89.61,54.36 | 89.61,54.36 89.61,55.07 89.41,55.07 88.59,55.88 SV1.2 84.18,54.25 v84.63,54.25
ITCK
  Top 0.254: R129.1 61.57,36.98 25.2,36.98 22.96,39.22 TP103.1
ITMS
  Top 0.254: R125.1 65.23,34.34 65.23,35.76 57.3,43.69 23.57,43.69 22.96,44.3 TP102.1
N$1
  Top 0.254: LV3HP2.4 SV3.4
N$2
  Top 0.254: SV3.5 77.62,90.22 82.5,95.1 LV3HP2.5
N$3
  Top 0.254: SV5.4 81.28,36.78 90.02,28.04 LV3HP3.4
N$4
  Top 0.254: LV3HP1.4 71.12,64.82 75.18,68.89 77.62,68.89 79.86,71.12 SV2.4
N$5
  Bottom 0.254: LV3HP1.5 68.68,64.82 72.75,68.89 80.26,68.89 82.5,71.12 SV2.5
N$6  (via drill 0.35)
  Top 0.254: R1.2 102.27,78.74 C2.1 104.29,76.72 v104.29,74.93 C1.1 | MSP1.87 103.29,63.59 103.29,64.45 102.92,64.82 | v102.16,66.04 102.16,65.58 102.92,64.82 | 102.92,64.82 v103.38,66.55 | v109.22,45.72 107.8,47.14 106.6,47.14 106.44,47.31 106.44,48.2 MSP1.45
  Bottom 0.254: v104.29,74.93 104.24,74.88 104.24,72.21 105.43,71.02 105.43,68.68 104.67,67.92 103.48,67.92 102.16,66.6 v102.16,66.04 | v109.22,45.72 107.34,47.6 107.34,59.4 105.41,61.33 105.41,62.23 v103.38,66.55
N$7
  Top 0.254: SV5.5 83.92,36.78 92.66,28.04 LV3HP3.5
N$8
  Top 0.254: SV7.4 55.88,54.66 60.96,54.66 LV3HP4.4
N$9
  Top 0.254: SV7.5 55.88,52.02 60.96,52.02 LV3HP4.5
N$10
  Top 0.254: U1.5 73.76,87.78 72.75,88.8 U1.12 | 71.93,89 U1.11 U1.12 | 72.75,89 U1.12
N$11
  Top 0.254: IC101.3 106.88,19.91 106.88,19.51 106.68,19.3 85.95,19.3 68.07,37.19 67.06,37.19 66.85,37.39 66.85,41.05 67.67,41.86 C19.1
N$13
  Top 0.254: LED4_YELLOW.2 14.63,76.81 14.63,79.45 12.8,81.28 LED5_RED.2 | LED6_YELLOW.2 91.44,104.24 91.03,104.24 87.99,107.29 86.97,107.29 85.14,109.12 LED3_RED.2 | LED1_RED.2 86.36,6.5 90.02,10.16 LED2_YELLOW.2 90.22,10.16 97.94,17.88 110.74,17.88 133.71,40.84 135.94,40.84 137.77,42.67 137.77,46.33 LED8_YELLOW.2 LED7_RED.2
  Bottom 0.254: LED6_YELLOW.2 91.44,96.52 LED7_RED.2 | LED5_RED.2 12.6,81.28 12.6,81.69 10.77,83.52 10.77,85.55 32.51,107.29 83.11,107.29 84.94,109.12 LED3_RED.2
N$34
  Top 0.254: C6.1 107.29,42.06 107.29,43.48 106.48,44.3 Q1.1 | 106.27,44.91 106.27,44.5 Q1.1 | MSP1.42 104.85,48.36 104.85,48.29 104.87,48.27 104.87,46.01 105.44,45.44 105.44,45.42 Q1.1
N$38
  Top 0.254: C5.1 104.65,40.64 104.65,44.09 104.44,44.3 Q1.2 104.44,44.5 104.44,48.16 MSP1.41
P1.0_LED1  (via drill 0.35)
  Top 0.254: v92.05,61.77 92.36,61.47 92.54,61.47 93.63,60.38 MSP1.4
  Bottom 0.254: SV1.6 87.78,66.04 89.2,64.62 91.81,64.62 92.3,64.13 92.3,63.23 92.05,62.98 v92.05,61.77
P1.1_BUTTON1
  Top 0.254: SV1.5 82.7,63.4 83.21,62.89 83.52,62.59 83.97,62.13 90.7,62.13 91.76,61.06 92.37,61.06 93.56,59.87 MSP1.5
P1.2_BCLUART_RXD  (via drill 0.35)
  Top 0.254: v91.64,60.4 92.41,59.64 93.22,59.64 93.47,59.38 MSP1.6
  Bottom 0.254: SV1.4 82.7,60.96 83.11,60.55 84.84,58.83 90.07,58.83 v91.64,60.4
P1.3_BCLUART_TXD  (via drill 0.35)
  Top 0.254: MSP1.7 93.4,58.88 93.05,59.23 91.88,59.23 90.99,60.13 90.99,60.14 90.78,60.35 90.78,60.47 90.42,60.82 v90.42,61.47
  Bottom 0.254: v90.42,61.47 90.93,60.96 91.27,60.96 91.37,61.06 91.92,61.06 92.3,60.67 92.3,60.13 90.59,58.42 SV1.3
P1.6_SPIMOSI_J2.15  (via drill 0.35)
  Top 0.254: v70.31,67.46 52.83,67.46 R3.2 | MSP1.10 94.21,57.38 93.98,57.61 93.98,57.73 92.88,58.83 91.03,58.83 89.66,60.2 84.33,60.2 83.82,59.69 80.47,59.69 79.78,60.38 79.78,65.96 78.48,67.27 78.48,68.84 | 76.2,64.82 LV3HP1.2 76.8,67.16 | SV2.2 74.98,71.12 76.81,72.95 80.47,72.95 81.08,72.34 81.05,72.31 81.05,69.93 80.44,69.32 78.95,69.32 78.48,68.84 | 76.8,67.16 v76.81,67.21 | 78.48,68.84 76.8,67.16
  Bottom 0.254: v70.31,67.46 70.71,67.46 72.54,69.29 72.95,69.29 74.78,71.12 SV2.2
P1.7_SPIMISO_J2.14
  Top 0.254: 69.9,65.84 69.09,66.65 65.63,66.65 62.99,64.01 51,64.01 50.39,64.62 R2.1 | 69.9,65.84 69.9,63.6 70.71,62.79 71.73,62.79 72.54,63.6 | 72.54,63.6 73.56,64.62 LV3HP1.3 | 72.54,63.6 81.48,54.66 82.55,54.61 83.74,54.84 84.35,55.45 84.35,57.68 86.36,59.69 88.9,59.69 90.17,58.42 92.71,58.42 93.57,57.56 93.57,57.44 94.05,56.96 95.16,56.96 MSP1.11 | 69.9,65.84 73.36,69.29 75.59,69.29 77.42,71.12 SV2.3
P2.0_RGBLED_RED
  Top 0.254: MSP1.16 93.3,54.38 91.39,52.48 88.49,52.48 SV4.6
P2.1_RGBLED_GREEN
  Top 0.254: SV4.5 88.9,52.07 91.56,52.07 92.77,53.28 93.3,53.81 95.19,53.81 MSP1.17
P2.2_RGBLED_BLUE  (via drill 0.35)
  Top 0.254: SV4.4 90.42,51.05 v90.42,51.41 | MSP1.18 95.16,53.3 93.37,53.3 91.89,51.83 91.89,51.15 v91.64,50.9
  Bottom 0.254: v91.64,50.9 90.93,50.9 v90.42,51.41
P2.3_IO_J4.34
  Top 0.254: MSP1.19 93.52,52.88 92.3,51.66 92.3,50.63 88.89,47.22 87.86,47.22 87.63,46.99 SV4.3
P3.0_IO_J2.18
  Top 0.254: MSP1.32 99.78,48.17 99.78,45.97 92.71,38.9 SV6.6
P3.1
  Top 0.254: MSP1.33 100.29,48.17 100.29,45.9 95.25,40.86 SV6.5
P3.2_URXD_J1.3
  Top 0.254: MSP1.34 100.8,48.2 100.8,45.84 97.79,42.83 SV6.4
P3.3_UTXD_J1.4
  Top 0.254: SV6.3 100.38,35.56 99.06,36.88 99.06,43.18 101.37,45.49 MSP1.35
P3.6_IO_J2.11  (via drill 0.35)
  Top 0.254: v64.82,44.3 54.05,44.3 R8.2 | MSP1.38 102.87,46.08 102.57,45.78 102.57,44.66 v101.35,43.43
  Bottom 0.254: v64.82,44.3 68.89,44.3 76.2,36.98 SV5.2 76.2,36.78 82.09,30.89 85.14,30.89 | v101.35,43.43 97.69,43.43 85.14,30.89 | 85.14,30.89 85.14,28.04 LV3HP3.2
P3.7_IO_J4.31  (via drill 0.35)
  Top 0.254: v62.99,76 62.99,93.88 R7.1 | LV3HP3.3 87.58,28.04 78.84,36.78 SV5.3 | MSP1.39 103.38,46.01 102.97,45.61 102.97,44.05 v101.09,42.16
  Bottom 0.254: v101.09,42.16 97.03,42.16 87.78,32.92 87.78,28.04 LV3HP3.3 | v62.99,76 62.99,66.65 58.73,62.38 58.73,54.46 59.94,53.24 62.38,53.24 78.64,36.98 SV5.3
P5.2/XT2IN
  Top 0.254: 110.49,66.04 109.53,66.04 106.68,68.89 Q2.1 | 110.49,66.04 C12.1 | MSP1.86 103.86,61.95 104.65,61.16 108.1,61.16 109.19,62.26 109.53,62.59 110.49,63.55 110.49,66.04
P5.3/XT2OUT  (via drill 0.35)
  Top 0.254: 108.71,68.07 108.31,68.07 107.9,68.48 107.9,69.7 108.92,70.71 Q2.3 | 108.71,68.07 112.78,68.07 114.4,66.45 114.4,51.41 111.35,48.36 111.35,44.5 C11.1 | MSP1.85 104.37,65.3 v104.85,65.79 | 108.71,68.07 v108.71,67.87
  Bottom 0.254: v108.71,67.87 108.15,67.31 106.38,67.31 v104.85,65.79
P6.4_I2CSDA_J1.10  (via drill 0.35)
  Top 0.254: v62.18,90.83 60.96,92.05 R6.2 | v108.41,65.33 107.9,64.82 107.9,63.6 MSP1.78 | v88.59,87.58 82.7,87.58 LV3HP2.2 SV3.2
  Bottom 0.254: v62.18,90.83 63.6,90.83 64.01,90.42 68.48,90.42 68.89,90.83 69.29,90.83 69.85,90.27 69.85,88.9 76.2,82.55 SV3.2 77.42,82.7 | v108.41,65.33 108.41,66.06 111.4,69.05 111.4,75.29 104.14,82.55 93.98,82.55 88.95,87.58 v88.59,87.58
P6.5_I2CSCL_J1.9  (via drill 0.35)
  Top 0.254: v64.21,91.24 64.21,77.62 R4.1 | v107.59,65.99 107.29,65.68 107.29,63.6 MSP1.79 | v86.97,88.39 84.33,88.39 LV3HP2.3 | 82.5,90.02 LV3HP2.3 | LV3HP2.3 80.75,88.37 80.75,87.2 80.99,86.95 80.99,86.65 79.44,85.09 SV3.3 v80.01,87.63
  Bottom 0.254: v64.21,91.24 73.03,91.24 73.69,90.58 74.52,90.58 74.93,90.17 74.93,87.63 75.23,87.63 76.28,88.67 78.66,88.67 79.7,87.63 v80.01,87.63 | v107.59,65.99 108.82,67.21 108.98,67.21 111,69.22 111,74.42 104.14,81.28 93.96,81.28 87.94,87.31 87.94,87.42 v86.97,88.39
P9.4
  Top 0.254: MSP1.96 98.88,64.43 98.61,64.71 98.61,65.22 96.47,67.36 96.47,67.5 95.84,68.12 95.71,68.12 92.71,71.12 92.71,74.93 SV8.6
P9.5
  Top 0.254: 98.2,64.54 98.2,64.77 | 98.2,64.77 98.2,64.8 | SV8.5 91.44,71.69 95.42,67.71 95.67,67.71 96.06,67.33 96.06,66.97 98.2,64.84 98.2,64.77 | 98.2,64.54 | 98.2,64.54 98.28,64.45 98.28,63.59 MSP1.97
P9.6  (via drill 0.35)
  Top 0.254: MSP1.98 97.79,63.58 97.79,64.63 95.4,67.02 v95.4,67.06
  Bottom 0.254: v95.4,67.06 95.4,68.58 89,74.98 89,76.2 SV8.4
P9.7
  Top 0.254: SV8.3 94.75,67.81 94.75,66.78 96.91,64.62 97.13,64.62 97.36,64.39 MSP1.99
P10.2  (via drill 0.35)
  Top 0.254: 55.88,59.74 53.44,62.18 48.97,62.18 R10.2 | v95.1,62.59 94.49,62.59 94.08,62.18 94.08,61.57 94.28,61.37 95.1,61.37 MSP1.2 | 55.88,59.74 60.96,59.74 LV3HP4.2 | 55.88,59.74 SV7.2
  Bottom 0.254: v95.1,62.59 96.11,62.59 98.55,60.15 98.55,58.73 96.93,57.1 63.5,57.1 63.2,57.1 62.18,56.08 59.74,56.08 59.13,56.69 59.13,57.71 60.96,59.54 LV3HP4.2
P10.3  (via drill 0.35)
  Top 0.254: v49.99,51.21 49.99,45.92 50.6,45.31 50.8,45.31 R9.1 | SV7.3 55.88,57.1 60.96,57.1 LV3HP4.3 | v91.64,63.5 91.64,63.3 92.71,62.23 92.85,62.23 94.05,61.03 94.12,60.96 94.97,60.96 95,60.94 95.13,60.96 95.17,60.96 MSP1.3
  Bottom 0.254: v49.99,51.21 55.88,57.1 SV7.3 | v91.64,63.5 91.64,64.21 90.42,64.21 87.17,60.96 84.94,60.96 83.72,62.18 65.84,62.18 60.96,57.3 LV3HP4.3
PG
  Top 0.254: U1.3 70.71,88.59 66.45,88.59 66.04,89 R11.2
SS
  Top 0.254: U1.1 70.71,90.22 70.31,90.22 69.09,91.44 C18.1
TCK_SWDCLK
  Top 0.254: MSP1.95 99.3,63.56 99.3,64.59 99.01,64.88 99.01,65.51 97.77,66.75 97.77,68.58 97.77,69.17 97.77,70.44 98.69,71.37 99.43,71.37 100.31,70.48 J8.4
TDI  (via drill 0.35)
  Top 0.254: v100.33,67.31 100.95,66.69 100.95,63.59 MSP1.92 | v102.87,72.39 J8.8
  Bottom 0.254: v100.33,67.31 99.31,68.33 96.7,68.33 96.32,68.72 96.32,73.47 96.37,73.53 96.37,73.88 96.76,74.27 100.99,74.27 v102.87,72.39
TDO_SWO  (via drill 0.35)
  Top 0.254: MSP1.93 100.29,63.59 100.29,64.75 100.08,64.96 v100.08,65.38
  Bottom 0.254: v100.08,65.38 103.03,68.33 104.51,68.33 105.02,68.85 105.02,70.85 104.51,71.37 102.5,71.37 101.99,70.85 101.97,70.85 J8.6
TMS_SWDIO
  Top 0.254: MSP1.94 99.87,64.59 99.42,65.05 99.42,65.68 98.18,66.92 98.18,69.94 98.34,70.1 98.67,70.1 J8.2
VCORE
  Top 0.254: L1.1 89.99,57 | C8.1 88.23,57.15 | 88.23,57.15 88.23,56.81 C10.1 | MSP1.12 91.84,56.39 91.41,56.82 L1.1 | 88.23,57.15 88.56,56.82 L1.1
VSW
  Top 0.254: MSP1.14 93.14,55.37 92.54,54.78 90.33,54.78 L1.2
XDSET_VCC  (via drill 0.35)
  Top 0.254: 64.01,35.76 64.01,34.34 R125.2 64.01,34.14 40.44,34.14 24.18,17.88 TP107.1 | 64.01,35.76 62.99,36.78 R129.2 | R1.1 99.57,78.64 98.55,77.62 98.55,77.47 C4.1 98.95,76.97 C3.+ | C3.+ 98.98,74.93 | v110.34,69.7 112.37,69.7 C7.1 | 96.32,48.16 96.32,49.38 97.54,50.6 97.54,55.07 | 96.32,48.16 96.32,43.08 90.17,36.93 90.17,34.29 92.96,31.5 94.08,31.5 104.85,20.73 105.05,20.73 105.66,20.12 IC101.1 | 97.54,55.07 96.72,55.88 MSP1.13 | 66.85,35.97 66.04,36.78 66.04,42.47 68.02,44.45 88.95,44.45 92.66,48.16 96.32,48.16 | 66.85,35.97 67.67,35.15 67.67,34.34 C105.1 | 97.54,55.07 102.62,55.07 v106.68,59.13 108.51,60.96 110.34,60.96 MSP1.73 | v64.21,35.76 64.01,35.76 | 66.85,35.97 v66.65,35.76 | C3.+ 97.63,73.61 v97.03,73.61
  Bottom 0.254: v97.03,73.61 96.72,73.3 96.72,68.89 98.73,68.89 J8.1 | v66.65,35.76 v64.21,35.76 | J8.1 98.68,68.83 | J8.1 100.31,67.97 | 100.31,67.97 100.6,67.97 100.99,67.58 100.99,67.04 100.6,66.65 99.67,66.65 | 99.67,66.65 99.06,66.04 99.06,64.77 104.7,59.13 v106.68,59.13 | 107.83,69.7 107.95,69.7 | 107.95,69.7 v110.34,69.7 | 100.31,67.97 100.25,67.97 99.48,68.74 | 107.95,69.7 104.95,72.7 104.95,75.2 104.56,75.59 97.5,75.59 95.91,74 95.91,68.55 97.81,66.65 99.67,66.65